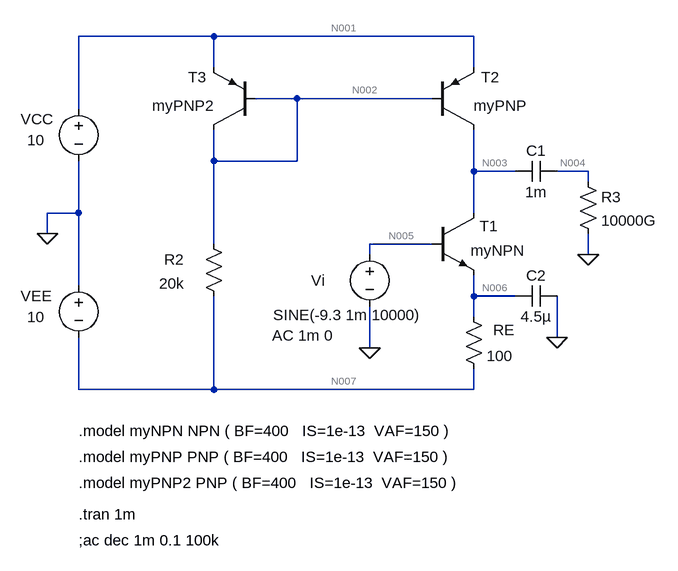
[diagram p0: schematic Progetto monografico Causa_Triglia.asc]
Progetto monografico Causa_Triglia.asc, the LTspice schematic file:
Version 4
SHEET 1 720 664
WIRE -288 -128 -496 -128
WIRE 112 -128 -288 -128
WIRE -288 -80 -288 -128
WIRE 112 -80 112 -128
WIRE -160 -32 -224 -32
WIRE 48 -32 -160 -32
WIRE -496 -16 -496 -128
WIRE -288 64 -288 16
WIRE -160 64 -160 -32
WIRE -160 64 -288 64
WIRE 112 80 112 16
WIRE 176 80 112 80
WIRE 288 80 240 80
WIRE 288 96 288 80
WIRE -496 144 -496 64
WIRE -496 144 -544 144
WIRE 112 144 112 80
WIRE -544 176 -544 144
WIRE -288 192 -288 64
WIRE 48 192 -48 192
WIRE -48 208 -48 192
WIRE 288 208 288 176
WIRE -496 256 -496 144
WIRE 112 272 112 240
WIRE 176 272 112 272
WIRE 112 304 112 272
WIRE 240 336 240 272
WIRE -48 352 -48 288
WIRE -496 416 -496 336
WIRE -288 416 -288 272
WIRE -288 416 -496 416
WIRE 112 416 112 384
WIRE 112 416 -288 416
FLAG -48 352 0
FLAG -544 176 0
FLAG 288 208 0
FLAG 240 336 0
SYMBOL voltage -48 192 R0
WINDOW 0 -90 56 Left 2
WINDOW 3 -149 109 Left 2
WINDOW 123 -150 141 Left 2
WINDOW 39 0 0 Left 2
SYMATTR InstName Vi
SYMATTR Value SINE(-9.3 1m 10000)
SYMATTR Value2 AC 1m 0
SYMBOL voltage -496 -32 R0
WINDOW 0 -89 32 Left 2
WINDOW 3 -79 64 Left 2
SYMATTR InstName VCC
SYMATTR Value 10
SYMBOL npn 48 144 R0
WINDOW 0 73 20 Left 2
WINDOW 3 59 58 Left 2
SYMATTR InstName T1
SYMATTR Value myNPN
SYMBOL voltage -496 240 R0
WINDOW 0 -89 32 Left 2
WINDOW 3 -79 64 Left 2
SYMATTR InstName VEE
SYMATTR Value 10
SYMBOL pnp 48 16 M180
WINDOW 0 75 81 Left 2
WINDOW 3 64 37 Left 2
SYMATTR InstName T2
SYMATTR Value myPNP
SYMBOL res -304 176 R0
WINDOW 0 -60 40 Left 2
WINDOW 3 -68 77 Left 2
SYMATTR InstName R2
SYMATTR Value 20k
SYMBOL cap 240 64 R90
WINDOW 0 0 32 VBottom 2
WINDOW 3 32 32 VTop 2
SYMATTR InstName C1
SYMATTR Value 1m
SYMBOL cap 240 256 R90
WINDOW 0 0 32 VBottom 2
WINDOW 3 32 32 VTop 2
SYMATTR InstName C2
SYMATTR Value 4.5µ
SYMBOL pnp -224 16 R180
WINDOW 0 75 81 Left 2
WINDOW 3 64 37 Left 2
SYMATTR InstName T3
SYMATTR Value myPNP2
SYMBOL res 96 288 R0
WINDOW 0 46 36 Left 2
SYMATTR InstName RE
SYMATTR Value 100
SYMBOL res 272 80 R0
SYMATTR InstName R3
SYMATTR Value 10000G
TEXT -496 480 Left 2 !.model myNPN NPN ( BF=400   IS=1e-13  VAF=150 )
TEXT -496 520 Left 2 !.model myPNP PNP ( BF=400   IS=1e-13  VAF=150 )
TEXT -496 560 Left 2 !.model myPNP2 PNP ( BF=400   IS=1e-13  VAF=150 )
TEXT -496 608 Left 2 !.tran 1m
TEXT -496 648 Left 2 !;ac dec 1m 0.1 100k

The netlist it stands for:
* Progetto monografico Causa_Triglia.asc
Vi N005 0 SINE(-9.3 1m 10000) AC 1m 0
VCC N001 0 10
Q§T1 N003 N005 N006 0 myNPN
VEE 0 N007 10
Q§T2 N003 N002 N001 0 myPNP
R2 N002 N007 20k
C1 N004 N003 1m
C2 0 N006 4.5µ
Q§T3 N002 N002 N001 0 myPNP2
RE N006 N007 100
R3 N004 0 10000G
.model NPN NPN
.model PNP PNP
.lib standard.bjt
.model myNPN NPN ( BF=400   IS=1e-13  VAF=150 )
.model myPNP PNP ( BF=400   IS=1e-13  VAF=150 )
.model myPNP2 PNP ( BF=400   IS=1e-13  VAF=150 )
.tran 1m
;ac dec 1m 0.1 100k
.backanno
.end

* Results of the author's LTspice run, read from the files saved beside the schematic
* Operating Point, zero values left out:
*   V(n005) = -9.3 V
*   V(n001) = 10 V
*   V(n003) = -2.564 V
*   V(n006) = -9.896 V
*   V(n007) = -10 V
*   V(n002) = 9.405 V
*   V(n004) = -25.39 mV
*   Ic(T3) = -965.4 µA
*   Ib(T3) = -2.414 µA
*   Ie(T3) = 967.9 µA
*   Ic(T2) = -1.042 mA
*   Ib(T2) = -2.414 µA
*   Ie(T2) = 1.045 mA
*   Ic(T1) = 1.042 mA
*   Ib(T1) = 2.494 µA
*   Ie(T1) = -1.045 mA
*   I(Re) = 1.045 mA
*   I(R2) = 970.3 µA
*   I(Vee) = -2.015 mA
*   I(Vcc) = -2.013 mA
*   I(Vi) = -2.494 µA
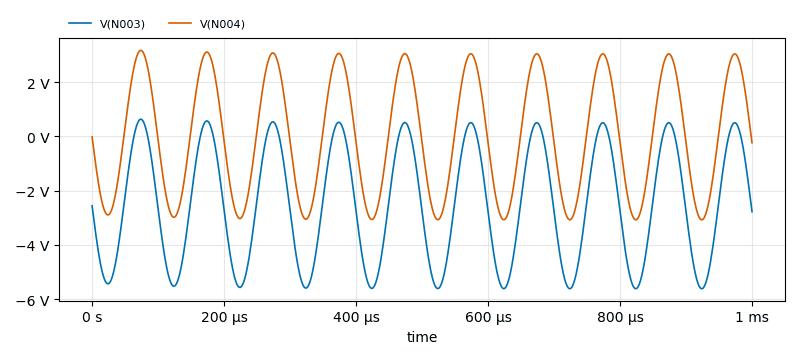
[diagram p1: Transient Analysis of Progetto monografico Causa_Triglia.asc, plotted from the saved traces]
* Transient Analysis, 1 run:
*   V(N003): min -5.624 V, max 627.2 mV, average -2.531 V, rms 3.328 V, last -2.779 V
*   V(N004): min -3.085 V, max 3.166 V, average 7.91 mV, rms 2.161 V, last -239.8 mV